# Altium project SCBD-10-63HP.PrjPcb
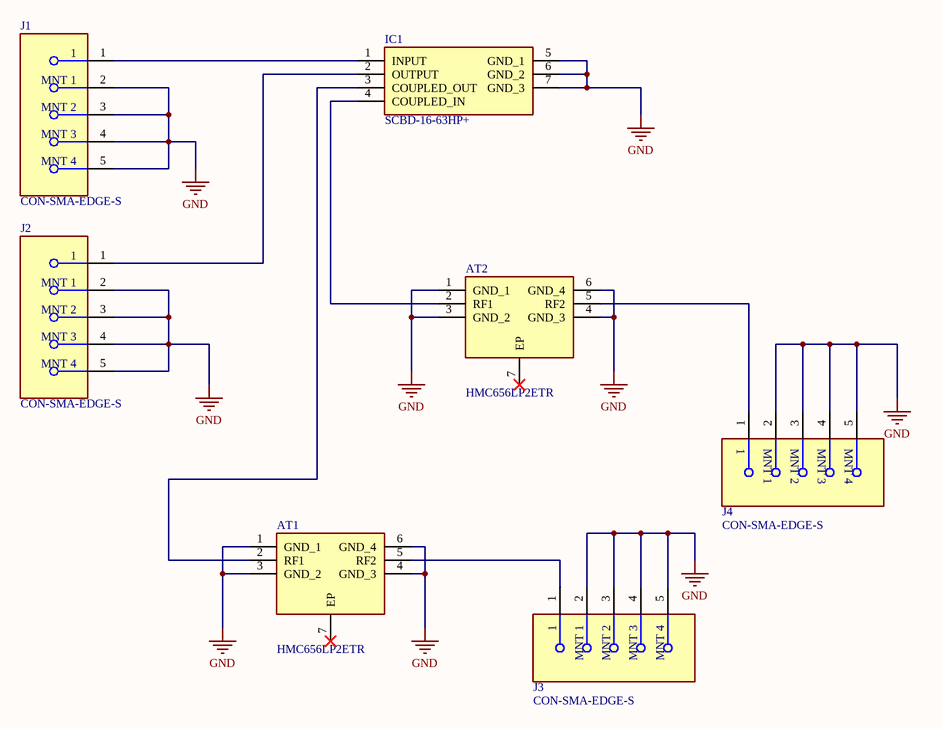
[diagram p0: SCBD-10-63HP.SchDoc]
1 sheet, 7 parts. Net scope: global (net labels, ports and power ports of the same name join across sheets).
Board file: SCBD-10-63HP.PcbDoc

## Sheet SCBD-10-63HP.SchDoc
size A

### Parts
AT1  HMC656LP2ETR  [SON65P200X200X100-7N]
AT2  HMC656LP2ETR  [SON65P200X200X100-7N]
IC1  SCBD-16-63HP+  [SCBD1663HP]
J1  CON-SMA-EDGE-S  [FP-CON-SMA-EDGE-S-MFG]
J2  CON-SMA-EDGE-S  [FP-CON-SMA-EDGE-S-MFG]
J3  CON-SMA-EDGE-S  [FP-CON-SMA-EDGE-S-MFG]
J4  CON-SMA-EDGE-S  [FP-CON-SMA-EDGE-S-MFG]

### Nets
GND: AT1.1(GND_1) AT1.3(GND_2) AT1.4(GND_3) AT1.6(GND_4) AT2.1(GND_1) AT2.3(GND_2) AT2.4(GND_3) AT2.6(GND_4) IC1.5(GND_1) IC1.6(GND_2) IC1.7(GND_3) J1.2(MNT_1) J1.3(MNT_2) J1.4(MNT_3) J1.5(MNT_4) J2.2(MNT_1) J2.3(MNT_2) J2.4(MNT_3) J2.5(MNT_4) J3.2(MNT_1) J3.3(MNT_2) J3.4(MNT_3) J3.5(MNT_4) J4.2(MNT_1) J4.3(MNT_2) J4.4(MNT_3) J4.5(MNT_4)
NetAT1_2: AT1.2(RF1) IC1.3(COUPLED_OUT)
NetAT1_5: AT1.5(RF2) J3.1
NetAT2_2: AT2.2(RF1) IC1.4(COUPLED_IN)
NetAT2_5: AT2.5(RF2) J4.1
NetIC1_1: IC1.1(INPUT) J1.1
NetIC1_2: IC1.2(OUTPUT) J2.1

Not connected (* = marked no-connect by the designer): AT1 7(EP)*; AT2 7(EP)*

### Library data of the parts
AT1 AT2 = HMC656LP2ETR: Attenuator or Isolator; Manufacturer_Name: Analog Devices; Datasheet Link: https://www.analog.com/media/en/technical-documentation/data-sheets/hmc656lp2-hmc658lp2.pdf; Height: 1mm; Manufacturer_Part_Number: HMC656LP2ETR; Mouser Part Number: 584-HMC656LP2ETR; Mouser Price/Stock: https://www.mouser.co.uk/ProductDetail/Analog-Devices/HMC656LP2ETR?qs=3izLlwrMQ7khzsLKjIESFw%3D%3D; Arrow Part Number: HMC656LP2ETR; Arrow Price/Stock: https://www.arrow.com/en/products/hmc656lp2etr/analog-devices
IC1 = SCBD-16-63HP+: Integrated Circuit; Manufacturer_Name: Mini-Circuits; Datasheet Link: https://www.mouser.com/ProductDetail/Mini-Circuits/PHA-202%2b?qs=xZ%2FP%252Ba9zWqZQB6K3pdIF%252Bw%3D%3D; Height: 3.56mm; Manufacturer_Part_Number: SCBD-16-63HP+; Mouser Part Number: 139-SCBD-16-63HP; Mouser Price/Stock: https://www.mouser.co.uk/ProductDetail/Mini-Circuits/SCBD-16-63HP%2b?qs=1Kr7Jg1SGW%252BMqB%2F891JKlw%3D%3D
J1-J4 = CMP-204357-000001-1: CONN SMA JACK STR EDGE MNT; Manufacturer: RF Solutions Ltd.; Impedance: 50Ω; Conn Orientation: Right Angle; Is Female: yes; Number Of Contacts: 1; Frequency: 18GHz; Shielding: true; Category: Conn; ComponentLink2URL: https://www.rfsolutions.co.uk/downloads/1498648656DS-CON-EDGE-SMA-4.pdf; Octopart: https://octopart.com/con-sma-edge-s-rf+solutions-70967450; Package: CONN_JACK; Manufacturer Part Number: CON-SMA-EDGE-S; Height: 6.35mm; Device Class L1: Connectors; Footprint Url: https://forum.upverter.com/uploads/default/original/3X/b/e/be75b907af57498775929d6d9099689c472e0307.pdf; Contact Material: Gold; ComponentLink2Description: Datasheet; Device Class L2: RF / Coaxial Connectors; RoHS: TRUE; Device Class L3: unset; Digikey Description: CONN SMA JACK STR EDGE MNT; Lead Free: Yes; Automotive: No